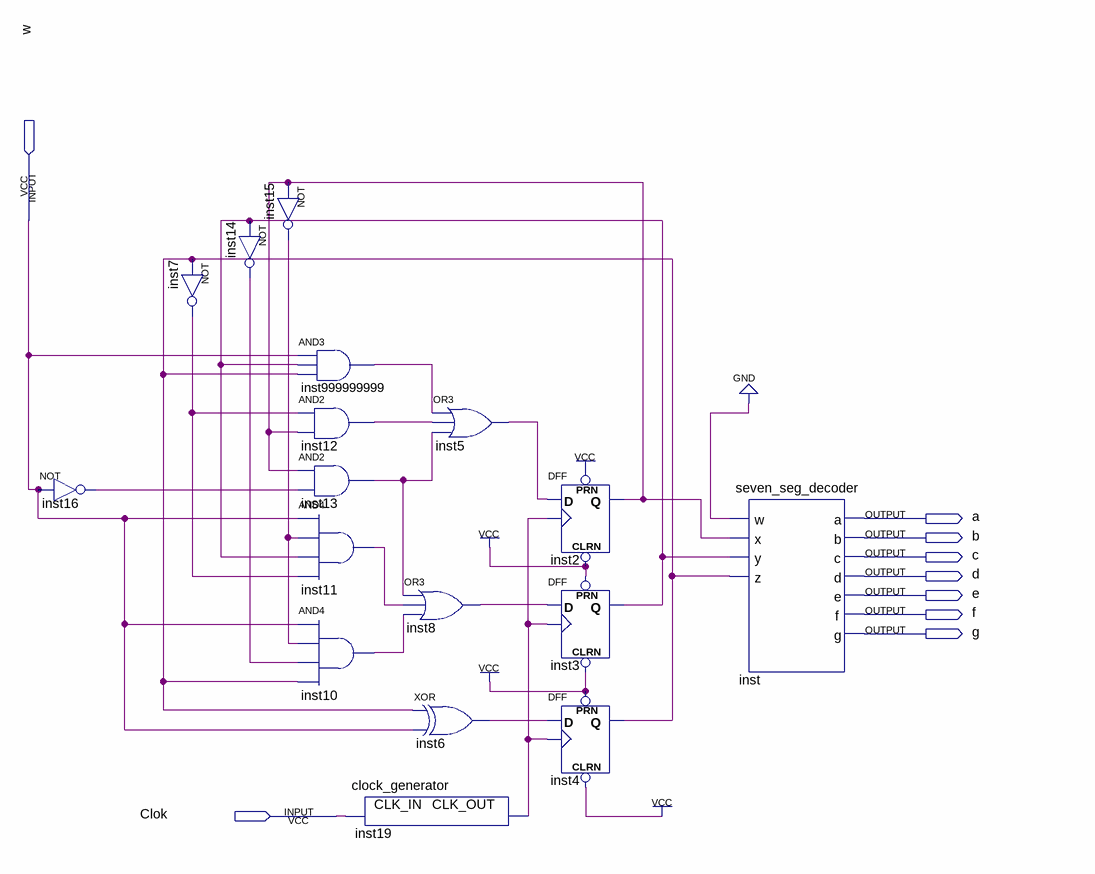
[diagram p0: schematic sheet]
// Quartus schematic lab11step1.bdf as structural Verilog: 17 symbols, 9 pins
module lab11step1 (
  input  w,
  input  Clok,
  output a,
  output b,
  output c,
  output d,
  output e,
  output f,
  output g
);

  wire inst2_q, inst3_q, inst4_q, inst5_out, inst6_out, inst7_out, inst8_out, inst10_out, inst11_out,
       inst12_out, inst13_out, inst14_out, inst15_out, inst16_out, inst19_clk_out, inst999999999_out;

  not inst16 (inst16_out, w);
  not inst7 (inst7_out, inst4_q);
  not inst15 (inst15_out, inst2_q);
  not inst14 (inst14_out, inst3_q);
  and inst999999999 (inst999999999_out, w, inst3_q, inst4_q);
  and inst12 (inst12_out, inst7_out, inst2_q);
  and inst13 (inst13_out, inst2_q, inst16_out);
  and inst11 (inst11_out, w, inst15_out, inst3_q, inst7_out);
  and inst10 (inst10_out, w, inst15_out, inst14_out, inst4_q);
  clock_generator inst19 (.CLK_IN(Clok), .CLK_OUT(inst19_clk_out));
  or inst5 (inst5_out, inst999999999_out, inst12_out, inst13_out);
  or inst8 (inst8_out, inst13_out, inst11_out, inst10_out);
  xor inst6 (inst6_out, inst4_q, w);
  DFF inst2 (.CLRN(1'b1), .CLK(inst19_clk_out), .D(inst5_out), .PRN(1'b1), .Q(inst2_q));
  DFF inst3 (.CLRN(1'b1), .CLK(inst19_clk_out), .D(inst8_out), .PRN(1'b1), .Q(inst3_q));
  DFF inst4 (.CLRN(1'b1), .CLK(inst19_clk_out), .D(inst6_out), .PRN(1'b1), .Q(inst4_q));
  seven_seg_decoder inst (
    .w(1'b0), .x(inst2_q), .y(inst3_q), .z(inst4_q), .a(a), .b(b), .c(c), .d(d), .e(e), .f(f), .g(g));
endmodule
